# EAGLE design main (EAGLE 7.6.0)
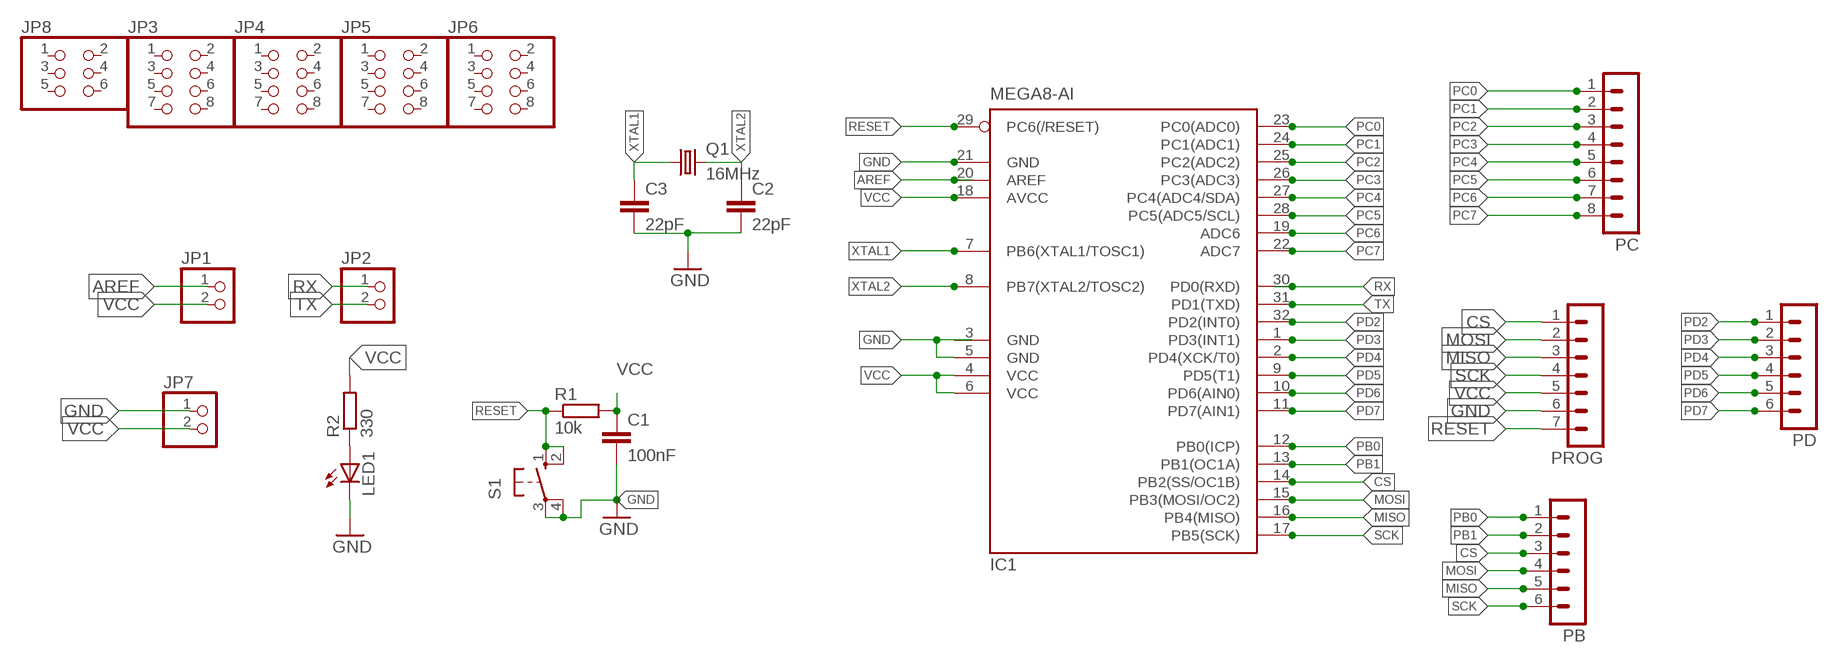
[diagram p0: schematic, sheet 1]

## Parts
C1  100nF  C-EU025-025X050  [C025-025X050]
C2  22pF  C-EU025-025X050  [C025-025X050]
C3  22pF  C-EU025-025X050  [C025-025X050]
IC1  MEGA8-AI  [TQFP32-08]
JP1  PINHD-1X2  [1X02]
JP2  PINHD-1X2  [1X02]
JP3  PINHD-2X4  [2X04]
JP4  PINHD-2X4  [2X04]
JP5  PINHD-2X4  [2X04]
JP6  PINHD-2X4  [2X04]
JP7  PINHD-1X2  [1X02]
JP8  PINHD-2X3  [2X03]
LED1  LED3MM  [LED3MM]
PB  MA06-1  [MA06-1]
PC  MA08-1  [MA08-1]
PD  MA06-1  [MA06-1]
PROG  MA07-1  [MA07-1]
Q1  16MHz  CRYSTALHC49S  [HC49/S]
R1  10k  R-EU_0207/12  [0207/12]
R2  330  R-EU_M0805  [M0805]
S1  10-XX  [B3F-10XX]

## Nets
AREF: IC1.20(AREF) JP1.1
CS: IC1.14(PB2(SS/OC1B)) PB.3 PROG.1
GND: C1.2 C2.2 C3.2 IC1.5(GND) IC1.21(GND) JP7.1 LED1.K(C) PROG.6 S1.3(P) S1.4(P1)
MISO: IC1.16(PB4(MISO)) PB.5 PROG.3
MOSI: IC1.15(PB3(MOSI/OC2)) PB.4 PROG.2
N$1: LED1.A R2.1
PB0: IC1.12(PB0(ICP)) PB.1
PB1: IC1.13(PB1(OC1A)) PB.2
PC0: IC1.23(PC0(ADC0)) PC.1
PC1: IC1.24(PC1(ADC1)) PC.2
PC2: IC1.25(PC2(ADC2)) PC.3
PC3: IC1.26(PC3(ADC3)) PC.4
PC4: IC1.27(PC4(ADC4/SDA)) PC.5
PC5: IC1.28(PC5(ADC5/SCL)) PC.6
PC6: IC1.19(ADC6) PC.7
PC7: IC1.22(ADC7) PC.8
PD2: IC1.32(PD2(INT0)) PD.1
PD3: IC1.1(PD3(INT1)) PD.2
PD4: IC1.2(PD4(XCK/T0)) PD.3
PD5: IC1.9(PD5(T1)) PD.4
PD6: IC1.10(PD6(AIN0)) PD.5
PD7: IC1.11(PD7(AIN1)) PD.6
RESET: IC1.29(PC6(/RESET)) PROG.7 R1.1 S1.1(S) S1.2(S1)
RX: IC1.30(PD0(RXD)) JP2.1
SCK: IC1.17(PB5(SCK)) PB.6 PROG.4
TX: IC1.31(PD1(TXD)) JP2.2
VCC: C1.1 IC1.4(VCC) IC1.6(VCC) IC1.18(AVCC) JP1.2 JP7.2 PROG.5 R1.2 R2.2
XTAL1: C3.1 IC1.7(PB6(XTAL1/TOSC1)) Q1.1
XTAL2: C2.1 IC1.8(PB7(XTAL2/TOSC2)) Q1.2
Unconnected: JP3.1 JP3.2 JP3.3 JP3.4 JP3.5 JP3.6 JP3.7 JP3.8 JP4.1 JP4.2 JP4.3 JP4.4 JP4.5 JP4.6 JP4.7 JP4.8 JP5.1 JP5.2 JP5.3 JP5.4 JP5.5 JP5.6 JP5.7 JP5.8 JP6.1 JP6.2 JP6.3 JP6.4 JP6.5 JP6.6 JP6.7 JP6.8 JP8.1 JP8.2 JP8.3 JP8.4 JP8.5 JP8.6

## Power pins joined to a net without a drawn wire
GND: IC1.3(GND)

## Library data of the parts
C1-C3 = resistor:C-EU: CAPACITOR, European symbol
IC1 = atmel:MEGA8: MICROCONTROLLER 8 Kbytes FLASH, 1 kbytes SRAM, 512 bytes EEPROM, USART, 6-channel 10 bit ADC, 2-channel 8 bit ADC Pin compatible with Atmega48, ATMega88, ATMega168 Source: avr.lbr; MPN: ATMEGA8-16AU; OC_FARNELL: 9171371; OC_NEWARK: 73M8863
JP1 JP2 JP7 = pinhead:PINHD-1X2: PIN HEADER
JP3-JP6 = pinhead:PINHD-2X4: PIN HEADER
JP8 = pinhead:PINHD-2X3: PIN HEADER
LED1 = adafruit:LED: LED OSRAM: - CHIPLED LG R971, LG N971, LY N971, LG Q971, LY Q971, LO R971, LY R971 LH N974, LH R974 LS Q976, LO Q976, LY Q976 LO Q996 - Hyper CHIPLED LW Q18S LB Q993, LB Q99A, LB R99A - SideLED LS A670, LO A670, LY A670, LG A670, LP A670 LB A673, LV A673, LT A673, LW A673 LH A674 LY A675 LS A676, LA A676, LO A676, LY A676, LW A676 LS A679, LY A679, LG A679 - Hyper Micro SIDELED® LS Y876, LA Y876, LO Y876, LY Y876 LT Y87S - SmartLED LW L88C, LW L88S LB L89C, LB L89S, LG L890 LS L89K, LO L89K, LY L89K LS L896, LA L896, LO L896, LY L896 - TOPLED LS T670, LO T670, LY T670, LG T670, LP T670 LSG T670, LSP T670, LSY T670, LOP T670, LYG T670 LG T671, LOG T671, LSG T671 LB T673, LV T673, LT T673, LW T673 LH T674 LS T676, LA T676, LO T676, LY T676, LB T676, LH T676, LSB T676, LW T676 LB T67C, LV T67C, LT T67C, LS T67K, LO T67K, LY T67K, LW E67C LS E67B, LA E67B, LO E67B, LY E67B, LB E67C, LV E67C, LT E67C LW T67C LS T679, LY T679, LG T679 LS T770, LO T770, LY T770, LG T770, LP T770 LB T773, LV T773, LT T773, LW T773 LH T774 LS E675, LA E675, LY E675, LS T675 LS T776, LA T776, LO T776, LY T776, LB T776 LHGB T686 LT T68C, LB T68C - Hyper Mini TOPLED® LB M676 - Mini TOPLED Santana® LG M470 LS M47K, LO M47K, LY M47K Source: http://www.osram.convergy.de/
PB PD = con-lstb:MA06-1: PIN HEADER; OC_FARNELL: unknown; OC_NEWARK: unknown
PC = con-lstb:MA08-1: PIN HEADER; OC_FARNELL: unknown; OC_NEWARK: unknown
PROG = con-lstb:MA07-1: PIN HEADER; OC_FARNELL: unknown; OC_NEWARK: unknown
Q1 = crystal:CRYSTAL: CRYSTAL; OC_FARNELL: 1667008; OC_NEWARK: unknown
R1 = resistor:R-EU_: RESISTOR, European symbol
R2 = rcl:R-EU_: RESISTOR, European symbol
S1 = switch-omron:10-XX: OMRON SWITCH; MPN: B3F-1000; OC_FARNELL: 176432; OC_NEWARK: 36M3542

## Board
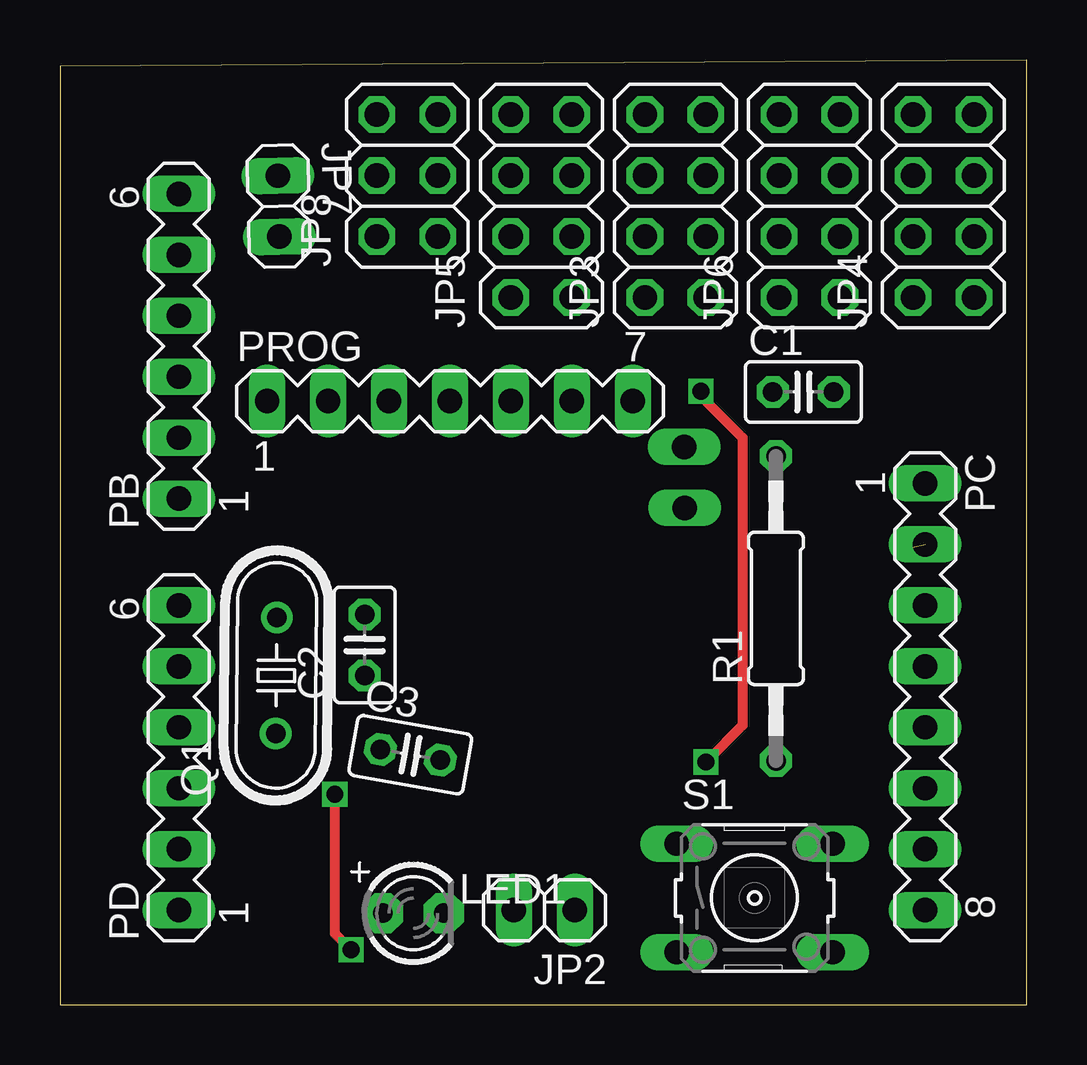
[diagram p1: board, top side]
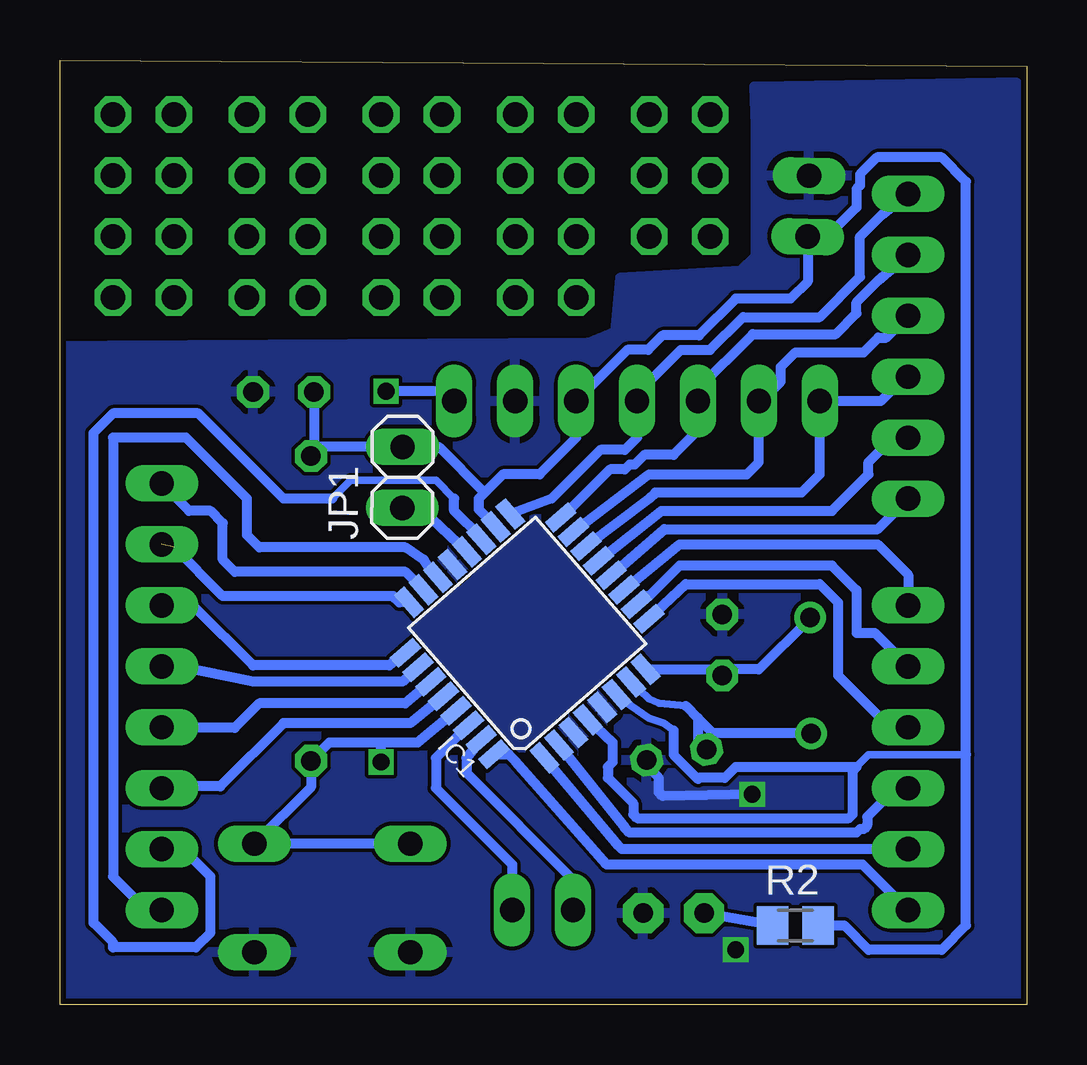
[diagram p2: board, bottom side, seen from below]

Size 40.31 x 39.36 mm. Coordinates in mm from the lower left corner, seen from the top.
Outline: 0,0 40.31,0 40.31,39.36 0,39.11 0,0
Copper layers (1*16): Top 0.035mm / dielectric 1.5mm / Bottom 0.035mm
Design rules "SeeedStudio_2layer_DRU_no_angle_20140221": minimum track width 6mil, minimum drill 12mil, track to track 6mil, track to pad 6mil, pad to pad 6mil, via to via 6mil, smd to smd 0mil, copper to edge 10mil, drill to drill 10mil, minimum pad ring 10mil, minimum via ring 6mil, stop-mask expansion 2mil, vias tented up to drill 100mil, thermal gap 10mil

### Footprints (pad centres in the part's own frame; a part is rotated, then mirrored left to right if it is on the bottom)
C025-025X050 = drill 0.813 octagon: 1 -1.27,0; 2 1.27,0
TQFP32-08 = smd 1.27 x 0.559: 1 -4.293,2.8; 2 -4.293,2; 3 -4.293,1.2; 4 -4.293,0.4; 5 -4.293,-0.4; 6 -4.293,-1.2; 7 -4.293,-2; 8 -4.293,-2.8; 17 4.293,-2.8; 18 4.293,-2; 19 4.293,-1.2; 20 4.293,-0.4; 21 4.293,0.4; 22 4.293,1.2; 23 4.293,2; 24 4.293,2.8 | smd 0.559 x 1.27: 9 -2.8,-4.293; 10 -2,-4.293; 11 -1.2,-4.293; 12 -0.4,-4.293; 13 0.4,-4.293; 14 1.2,-4.293; 15 2,-4.293; 16 2.8,-4.293; 25 2.8,4.293; 26 2,4.293; 27 1.2,4.293; 28 0.4,4.293; 29 -0.4,4.293; 30 -1.2,4.293; 31 -2,4.293; 32 -2.8,4.293
1X02 = drill 1.016 long: 1 -1.27,0; 2 1.27,0
2X04 = drill 1.016 octagon: 1 -3.81,-1.27; 2 -3.81,1.27; 3 -1.27,-1.27; 4 -1.27,1.27; 5 1.27,-1.27; 6 1.27,1.27; 7 3.81,-1.27; 8 3.81,1.27
2X03 = drill 1.016 octagon: 1 -2.54,-1.27; 2 -2.54,1.27; 3 0,-1.27; 4 0,1.27; 5 2.54,-1.27; 6 2.54,1.27
LED3MM = drill 0.813 pad 1.676 octagon: A -1.27,0; K 1.27,0
MA06-1 = drill 1.016 long: 1 -6.35,0; 2 -3.81,0; 3 -1.27,0; 4 1.27,0; 5 3.81,0; 6 6.35,0
MA08-1 = drill 1.016 long: 1 -8.89,0; 2 -6.35,0; 3 -3.81,0; 4 -1.27,0; 5 1.27,0; 6 3.81,0; 7 6.35,0; 8 8.89,0
MA07-1 = drill 1.016 long: 1 -7.62,0; 2 -5.08,0; 3 -2.54,0; 4 0,0; 5 2.54,0; 6 5.08,0; 7 7.62,0
HC49/S = drill 0.813: 1 -2.413,0; 2 2.413,0
0207/12 = drill 0.813 octagon: 1 -6.35,0; 2 6.35,0
M0805 = smd 1.3 x 1.6: 1 -0.95,0; 2 0.95,0
B3F-10XX = drill 1.016 long: 1 -3.251,2.261; 2 3.251,2.261; 3 -3.251,-2.261; 4 3.251,-2.261

### Placement (x,y rotation side)
C1  30.99,25.53 0 top
C2  12.7,14.99 90 top
C3  14.61,10.41 349.8 top
IC1  20.83,15.37 131.1 bottom
JP1  26.04,21.97 89.7 bottom
JP2  20.19,3.94 180 top
JP3  25.65,33.27 90 top
JP4  36.83,33.27 90 top
JP5  20.07,33.27 90 top
JP6  31.24,33.27 90 top
JP7  9.11,33.27 271.3 top
JP8  14.48,34.54 90 top
LED1  14.73,3.81 0 top
PB  4.95,27.43 90 top
PC  36.07,12.83 270 top
PD  4.95,10.29 90 top
PROG  16.26,25.15 0 top
Q1  9.02,13.72 89.4 top
R1  29.85,16.51 90 top
R2  9.65,3.3 0 bottom
S1  28.96,4.45 0 top

### Tracks (layer width: path | path; a pad name or v marks a point on that pad's centre or on a via)
AREF
  Bottom 0.406: IC1.20 25.15,20.57 JP1.1
CS
  Bottom 0.406: IC1.14 15.75,21.08 15.49,21.34 9.4,21.34 8.64,22.1 PROG.1 6.1,25.15 5.08,26.16 PB.3
GND  (via drill 0.7)
  Top 0.406: v11.46,8.76 11.46,2.97 v12.14,2.29
  Bottom 0.406: v11.46,8.76 15.19,8.69 15.34,8.84 15.34,9.45 15.95,10.06
  pour Bottom: 0.13,-0.25 0.38,35.18 0.41,38.4 1.27,38.4 11.38,38.25 11.33,36.63 11.33,31.19 11.94,30.58 16.97,30.28 17.17,28.04 18.29,27.58 41.66,27.43 41.66,-1.52 0.13,-1.52
MISO
  Bottom 0.406: IC1.16 19.06,20.68 19,20.68 17.37,22.3 16.76,22.3 16.56,22.5 16.36,22.5 15.95,22.91 14.73,22.91 13.72,23.93 PROG.3 13.72,25.65 11.43,27.94 7.98,27.94 7.11,28.8 7.11,29.26 6.2,30.18 PB.5
MOSI
  Bottom 0.406: IC1.15 15.75,22.1 11.68,22.1 11.18,22.61 PROG.2 11.07,25.15 10.26,25.96 10.26,26.57 9.65,27.18 6.81,27.18 6.2,27.79 5.87,27.79 PB.4
N$1
  Bottom 0.406: R2.1 LED1.A
PB0
  Bottom 0.406: IC1.12 15.11,19.81 6.22,19.81 PB.1
PB1
  Bottom 0.406: IC1.13 15.24,20.57 8.13,20.57 6.6,22.1 6.6,22.61 6.1,23.11 5.46,23.11 PB.2
PC0
  Bottom 0.406: IC1.23 25.91,18.03 33.02,18.03 33.53,18.54 33.53,20.07 34.04,20.57 34.93,20.57 PC.1
PC1  (1 unrouted)
  Bottom 0.406: IC1.24 26.16,16.76 26.42,17.02 33.53,17.02 35.56,19.05
PC2
  Bottom 0.406: IC1.25 26.58,14.13 32.27,14.13 34.69,16.55 35.98,16.55 PC.3
PC3
  Bottom 0.406: PC.4 35.43,14.1 32.26,13.46 26.04,13.46 IC1.26
PC4
  Bottom 0.406: IC1.27 25.91,12.55 32,12.55 33.02,11.53 36.04,11.53 PC.5
PC5
  Bottom 0.406: IC1.28 25.71,11.74 30.99,11.74 33.63,9.09 35.99,9.09 PC.6
PC6
  Bottom 0.305: 23.88,21.08 24.64,21.84 28.19,21.84 28.96,21.08
  Bottom 0.406: IC1.19 22.75,19.44 23.88,20.57 23.88,21.08 | 28.96,21.08 30.99,21.08 34.54,24.64 38.1,24.64 38.91,23.82 38.91,3.4 38.1,2.59 38.1,2.39 34.65,2.39 34.04,3 34.04,5.33 35.05,6.35 35.94,6.35 PC.7
PC7
  Bottom 0.406: IC1.22 24.67,17.81 25.15,18.54 25.91,19.05 32,19.05 32.51,19.56 32.51,21.08 35.05,23.62 38.1,23.62 38.1,5.33 36.7,3.94 PC.8
PD2
  Bottom 0.406: IC1.32 21.61,10.44 21.34,10.16 17.53,5.84 6.86,5.84 PD.1
PD3
  Bottom 0.406: PD.2 16.89,6.48 17.02,6.6 IC1.1
PD4
  Bottom 0.406: IC1.2 16.76,7.37 16.56,7.16 7.11,7.16 6.96,7.31 6.81,7.31 6.66,7.47 6.66,7.82 5.59,8.89 5.08,8.89 PD.3
PD5
  Bottom 0.406: IC1.9 14.22,17.53 8.64,17.53 7.87,16.76 7.87,13.72 5.59,11.43 5.08,11.43 PD.4
PD6
  Bottom 0.406: 16.28,16.74 IC1.10 15.94,17.02 15.75,17.02 14.48,18.29 8.13,18.29 7.11,17.27 7.11,15.49 6.35,15.49 PD.5
PD7
  Bottom 0.406: IC1.11 14.48,19.18 6.22,19.18 4.95,17.91 PD.6
RESET  (via drill 0.7)
  Top 0.406: 26.72,10.31 v26.92,10.11 28.45,11.63 28.45,23.62 26.72,25.35 v26.72,25.55
  Bottom 0.406: IC1.29 25.4,10.92 26.92,10.92 | 26.92,10.92 29.08,10.92 R1.1 29.85,9.07 S1.2 S1.1 | v26.92,10.11 26.92,10.92 | PROG.7 24.28,25.55 v26.72,25.55
RX
  Bottom 0.406: IC1.30 24.64,10.29 24.64,9.02 21.46,5.84 JP2.1
SCK
  Bottom 0.406: IC1.17 19.81,21.08 17.78,23.11 16.76,23.11 16.26,23.62 PROG.4 16.26,25.45 14.43,27.28 13.21,27.28 11.84,28.65 8.64,28.65 6.96,30.33 6.96,32 6.05,32.92 PB.6
TX
  Bottom 0.406: IC1.31 23.37,10.29 23.37,9.65 18.92,5.21 JP2.2
VCC
  Bottom 0.305: 2.54,10.41 6.6,10.41 7.11,9.91 | IC1.6 16.51,12.45 15.75,11.94 15.14,11.74 14.73,11.43
  Bottom 0.406: R2.2 7.62,3.3 6.6,2.29 3.56,2.29 2.54,3.3 2.54,10.41 2.54,34.29 3.56,35.31 6.25,35.31 6.96,34.59 6.96,34.14 7.11,33.98 7.11,33.22 8.34,32 JP7.2 9.14,30.13 9.86,29.41 12.14,29.41 13.66,27.89 15.19,27.89 15.8,27.28 16.66,27.28 PROG.5 18.8,23.62 20.32,22.1 21.84,22.1 22.61,21.34 | 29.5,25.53 C1.1 29.72,22.99 R1.2 29.46,23.24 JP1.2 24.51,23.24 22.61,21.34 | 22.61,21.34 22.86,21.08 22.86,20.63 IC1.18 | IC1.4 17.27,10.92 17.27,10.11 17.48,9.91 17.48,9.45 16.41,8.38 16.41,7.93 16.26,7.77 7.42,7.77 7.26,7.93 7.26,9.75 7.11,9.91 12.14,9.91 12.6,9.45 13.66,9.45 13.72,9.4 14.73,10.41 14.73,11.43
XTAL1
  Bottom 0.305: IC1.7 15.75,12.75 15.34,12.55 14.22,12.45
  Bottom 0.406: 14.22,12.45 13.72,11.94 | 13.72,11.94 13.72,11 C3.1 | Q1.1 13.08,11.3 13.72,11.94
XTAL2
  Bottom 0.406: IC1.8 12.96,13.97 C2.1 12.45,13.97 11.18,13.97 9.12,16.02 Q1.2